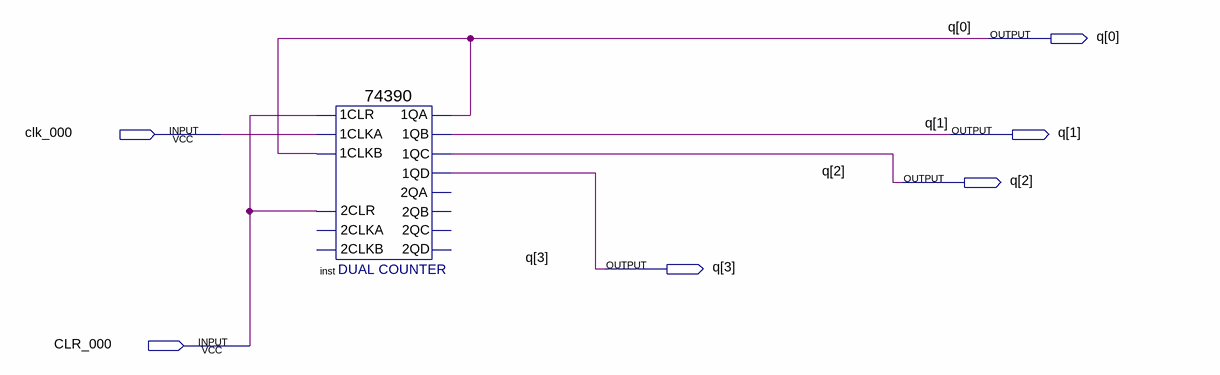
[diagram p0: schematic sheet]
// Quartus schematic Ucnt10.bdf as structural Verilog: 1 symbols, 6 pins
module Ucnt10 (
  input  clk_000,
  input  CLR_000,
  output [3:0] q
);

  \74390  inst (
    .\2CLR (CLR_000), .\1CLR (CLR_000), .\1CLKA (clk_000), .\1CLKB (q[0]), .\1QA (q[0]), .\1QB (q[1]),
    .\1QC (q[2]), .\1QD (q[3]));  // open: 2CLKA, 2CLKB, 2QA, 2QB, 2QC, 2QD
endmodule
